# EAGLE schematic Lora Soil Moisture Sensor v1.1 (EAGLE 6.1)
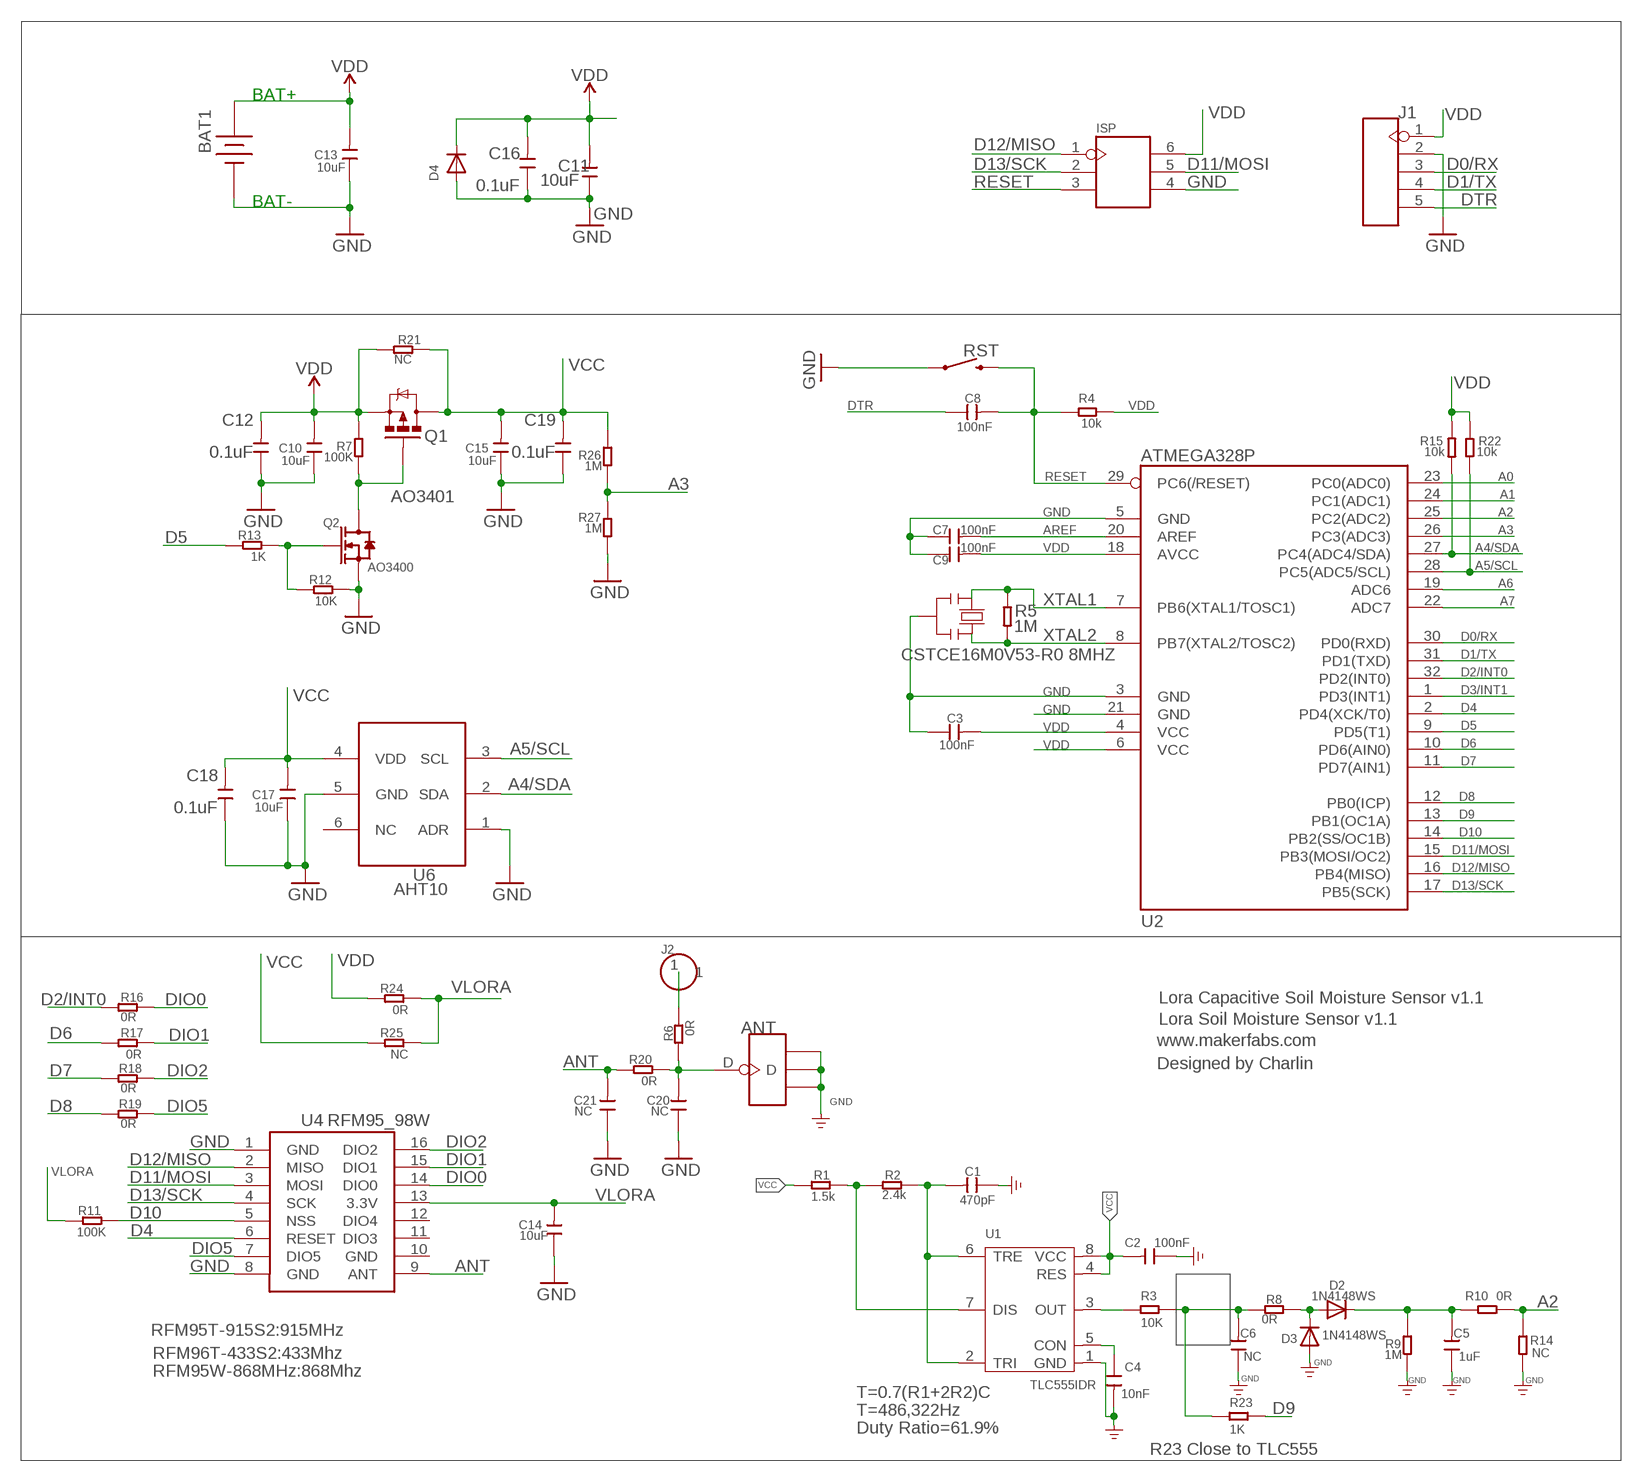
[diagram p0: schematic, sheet 1]

## Parts
ANT  ANTENNA-U-FL  [4P-U-FL]
BAT1  18650  [18650]
C1  470pF  CAP-0603  [C0603]
C2  100nF  CAP-0603  [C0603]
C3  100nF  C-0603  [0603]
C4  10nF  CAP-0603  [C0603]
C5  1uF  DISCRETE_C-0603  [DISCRETE_C0603]
C6  NC  DISCRETE_C-0603  [DISCRETE_C0603]
C7  100nF  C-0603  [0603]
C8  100nF  C-0603  [0603]
C9  100nF  C-0603  [0603]
C10  10uF  C-0603  [0603]
C11  10uF  C-0603  [0603]
C12  0.1uF  C-0603  [0603]
C13  10uF  C-0603  [0603]
C14  10uF  C-0603  [0603]
C15  10uF  C-0603  [0603]
C16  0.1uF  C-0603  [0603]
C17  10uF  C-0603  [0603]
C18  0.1uF  C-0603  [0603]
C19  0.1uF  C-0603  [0603]
C20  NC  C-0603  [0603]
C21  NC  C-0603  [0603]
D2  1N4148WS  DIODESOD-323F  [SOD-323F]
D3  1N4148WS  DIODESOD-323F  [SOD-323F]
D4  DIODESOD-323F  [SOD-323F]
ISP  HEADER-2X3P-SMD  [2X3P-2.54-SMD]
J1  HEADER-5P-2.54  [5P-2.54]
J2  HEADER-1P-50  [1P-100/50MIL]
Q1  MOSFET-PCHANNEL  [SOT23-3]
Q2  AO3400  DISCRETE_MOSFET-NSOT23  [DISCRETE_SOT23]
R1  1.5k  RES-0603  [R0603]
R2  2.4k  RES-0603  [R0603]
R3  10K  RES-0603  [R0603]
R4  10k  R-0603  [R0603]
R5  1M  R-0603  [R0603]
R6  0R  R-0603  [R0603]
R7  100K  R-0603  [R0603]
R8  0R  R-0603  [R0603]
R9  1M  R-0603  [R0603]
R10  0R  R-0603  [R0603]
R11  100K  R-0603  [R0603]
R12  10K  R-0603  [R0603]
R13  1K  R-0603  [R0603]
R14  NC  R-0603  [R0603]
R15  10k  R-0603  [R0603]
R16  0R  R-0603  [R0603]
R17  0R  R-0603  [R0603]
R18  0R  R-0603  [R0603]
R19  0R  R-0603  [R0603]
R20  0R  R-0603  [R0603]
R21  NC  R-0603  [R0603]
R22  10k  R-0603  [R0603]
R23  1K  RES-0603  [R0603]
R24  0R  R-0603  [R0603]
R25  NC  R-0603  [R0603]
R26  1M  R-0603  [R0603]
R27  1M  R-0603  [R0603]
RST  MOMENTARY-SWITCH-SPST-SMD-6.0X3.5MM  [TACTILE_SWITCH_SMD_6.0X3.5MM]
U1  TLC555IDR  CLOCK/TIMING-NE555'DR'  [SOIC8-1.27-5X4MM]
U2  ATMEGA328P  ATMEGA8/168/328  [TQFP32]
U4  RFM95_98W  RFM92_93W  [RFM92_93W]
U6  AHT10  [SMD6-127P-400L500W]
Y1  CSTCE16M0V53-R0 8MHZ  RESONATORMU  [RESONATOR]

## Nets
A0: U2.23(PC0(ADC0))
A1: U2.24(PC1(ADC1))
A2: R10.2 R14.1 U2.25(PC2(ADC2))
A3: R26.1 R27.2 U2.26(PC3(ADC3))
A4/SDA: R15.2 U2.27(PC4(ADC4/SDA)) U6.2(SDA)
A5/SCL: R22.2 U2.28(PC5(ADC5/SCL)) U6.3(SCL)
A6: U2.19(ADC6)
A7: U2.22(ADC7)
ANT: C21.2 R20.2 U4.9(ANT)
AREF: C7.2 U2.20(AREF)
D0/RX: J1.3 U2.30(PD0(RXD))
D1/TX: J1.4 U2.31(PD1(TXD))
D2/INT0: R16.1 U2.32(PD2(INT0))
D3/INT1: U2.1(PD3(INT1))
D4: U2.2(PD4(XCK/T0)) U4.6(RESET)
D5: R13.2 U2.9(PD5(T1))
D6: R17.1 U2.10(PD6(AIN0))
D7: R18.1 U2.11(PD7(AIN1))
D8: R19.1 U2.12(PB0(ICP))
D9: R23.2 U2.13(PB1(OC1A))
D10: R11.1 U2.14(PB2(SS/OC1B)) U4.5(NSS)
D11/MOSI: ISP.5 U2.15(PB3(MOSI/OC2)) U4.3(MOSI)
D12/MISO: ISP.1 U2.16(PB4(MISO)) U4.2(MISO)
D13/SCK: ISP.2 U2.17(PB5(SCK)) U4.4(SCK)
DIO0: R16.2 U4.14(DIO0)
DIO1: R17.2 U4.15(DIO1)
DIO2: R18.2 U4.16(DIO2)
DIO5: R19.2 U4.7(DIO5)
DTR: C8.1 J1.5
GND: ANT.GND1 ANT.GND2 ANT.GND3 BAT1.2 C1.1 C2.1 C3.1 C4.2 C5.1 C6.1 C7.1 C9.1 C10.1 C11.1 C12.1 C13.1 C14.1 C15.1 C16.1 C17.1 C18.1 C19.1 C20.1 C21.1 D3.A D4.A ISP.4 J1.2 Q2.2(S) R9.1 R12.1 R14.2 R27.1 RST.1 U1.1(GND) U2.3(GND) U2.5(GND) U2.21(GND) U4.1(GND) U4.8(GND) U6.1(ADR) U6.5(GND) Y1.2
N$1: R1.1 R2.2 U1.7(DIS)
N$2: C1.2 R2.1 U1.2(TRI) U1.6(TRE)
N$3: C4.1 U1.5(CON)
N$4: R3.1 U1.3(OUT)
N$5: C6.2 R3.2 R8.1 R23.1
N$6: J2.1 R6.1
N$8: Q1.1(G) Q2.3(D) R7.1
N$9: D2.A D3.C R8.2
N$10: Q2.1(G) R12.2 R13.1
N$11: C5.2 D2.C R9.2 R10.1
N$12: ANT.D C20.2 R6.2 R20.1
RESET: C8.2 ISP.3 R4.2 RST.2 U2.29(PC6(/RESET))
VCC: C2.2 C15.2 C17.2 C18.2 C19.2 Q1.3(D) R1.2 R21.1 R25.2 R26.2 U1.4(RES) U1.8(VCC) U6.4(VDD)
VDD: BAT1.1 C3.2 C9.2 C10.2 C11.2 C12.2 C13.2 C16.2 D4.C ISP.6 J1.1 Q1.2(S) R4.1 R7.2 R15.1 R21.2 R22.1 R24.2 U2.4(VCC) U2.6(VCC) U2.18(AVCC)
VLORA: C14.2 R11.2 R24.1 R25.1 U4.13(3.3V)
XTAL1: R5.2 U2.7(PB6(XTAL1/TOSC1)) Y1.1
XTAL2: R5.1 U2.8(PB7(XTAL2/TOSC2)) Y1.3
Unconnected: U4.11(DIO3) U4.12(DIO4) U6.6(NC)

## Notes on the sheet
- BAT+
- BAT-
- AO3401
- Lora Capacitive Soil Moisture Sensor v1.1
- Lora Soil Moisture Sensor v1.1
- www.makerfabs.com
- Designed by Charlin
- RFM95T-915S2:915MHz
- RFM96T-433S2:433Mhz
- RFM95W-868MHz:868Mhz
- T=0.7(R1+2R2)C
- T=486,322Hz
- Duty Ratio=61.9%
- R23 Close to TLC555

## Power pins joined to a net without a drawn wire
GND: U4.10(GND)

## Library data of the parts
ANT = Connector:ANTENNA-U-FL
BAT1 = BAT:18650
C1 C2 C4 = Discrete-new:CAP: Ceramic Capacitors
C3 C7-C21 = Discrete:C*: Ceramic Capacitors
C5 C6 = A9G:DISCRETE_C*: Ceramic Capacitors
D2-D4 = adafruit2:DIODE: Diode SMADIODE - SMA Surface Mount Package 20V 1A Schottky Diode Digikey: 641-1014-6-ND DO-1N4148 - Through Hole Small Current Diode SOD-123 20V 1 A (.5mV Vf) Schottky Diode - Digikey: MBRX120TPMSCT-ND SOD-323 10V 570mA (.38mV Vf, 3ns) Schottky Diode - Digikey: ZLLS410CT-ND SOD-523 30V 30mA Schottky Diode (RB751S-40TE61) - Digikey: RB751S-40TE61CT-ND SOT23-R/W - SOT23 Package (R = Solder Paste/Reflow Ovens, W = Hand-Soldering) BAT54Film 40V 300mA - Digikey: 497-7162-1-ND
ISP = Connector:HEADER-2X3P
J1 = Connector:HEADER-5P
J2 = Connector:HEADER-1P
Q1 = User-Submitted:MOSFET-PCHANNEL: Generic PMOSFET IRLML2244 - TRANS-11153 (SOT-23 -20V -4.3A) (1.Gate 2.Source 3.Drain) FQP27P06 - COM-10349 <http://www.sparkfun.com/products/10349> (TO-220 -60V -27A) (1.Gate 2.Source 3.Drain); PROD_ID: TRANS-08285
Q2 = A9G:DISCRETE_MOSFET-N: IRLL014: http://www.vishay.com/docs/91319/sihll014.pdf
R1-R3 R23 = Discrete-new:RES
R4-R22 R24-R27 = Discrete:R*
RST = SparkFun-Switches:MOMENTARY-SWITCH-SPST: Momentary Switch (Pushbutton) - SPST Normally-open (NO) SPST momentary switches (buttons, pushbuttons). Variants PTH-12MM - 12mm square, through-hole Momentary Pushbutton Switch - 12mm Square <https://www.sparkfun.com/products/9190> (COM-09190) PTH-6.0MM, PTH-6.0MM-KIT - 6.0mm square, through-hole Mini Pushbutton Switch <https://www.sparkfun.com/products/97> (COM-00097) KIT package intended for soldering kit's - only one side of pads' copper is exposed. PTH-RIGHT-ANGLE-KIT - Right-angle, through-hole Right Angle Tactile Button <https://www.sparkfun.com/products/10791> - Used on SparkFun BigTime Watch Kit <https://www.sparkfun.com/products/11734> SMD-12MM - 12mm square, surface-mount Tactile Button - SMD (12mm) <https://www.sparkfun.com/products/12993> (COM-12993) Used on SparkFun PicoBoard <https://www.sparkfun.com/products/11888> SMD-4.5MM - 4.5mm Square Trackball Switch Used on SparkFun Blackberry Trackballer Breakout <https://www.sparkfun.com/products/13169> SMD-4.6MMX2.8MM - 4.60mm x 2.80mm, surface mount Used on SparkFun SAMD21 Mini Breakout <https://www.sparkfun.com/products/13664> SMD-5.2MM, SMD-5.2-REDUNDANT - 5.2mm square, surface-mount Mini Pushbutton Switch - SMD <https://www.sparkfun.com/products/8720> (COM-08720) Used on Arduino Pro Mini <https://www.sparkfun.com/products/11114> REDUNDANT package connects both switch circuits together SMD-6.0X3.5MM - 6.0 x 3.5mm, surface mount Momentary Reset Switch SMD <https://www.sparkfun.com/products/8229> (COM-08229) SMD-6.2MM-TALL - 6.2mm square, surface mount Tactile Button - SMD (6mm) <https://www.sparkfun.com/products/12992> Used on SparkFun Digital Sandbox <https://www.sparkfun.com/products/12651> SMD-RIGHT-ANGLE - Right-angle, surface mount Used on SparkFun Block for Intel® Edison - Arduino <https://www.sparkfun.com/products/13036>; PROD_ID: SWCH-00815; SF_SKU: COM-08229
U1 = IC-new:CLOCK/TIMING-NE555: DIP-8:310110001;SOIC-8:310110013;TSSOP-8:310110002
U2 = IC:ATMEGA8/168/328: MICROCONTROLLER
U4 = dragino:RFM92_93W
U6 = self:AHT10
Y1 = SmartPrj:RESONATOR

## Net classes
0 default: width 0.152 mm, drill 0.305 mm, clearance 0.152 mm